# EAGLE design diode2 (EAGLE 9.6.2)
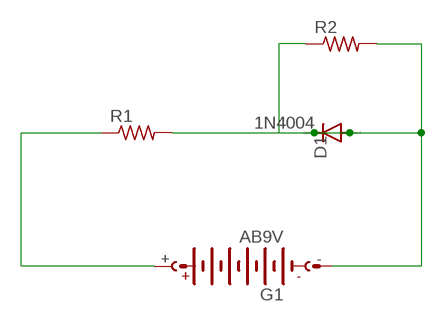
[diagram p0: schematic, sheet 1]

## Parts
D1  1N4004  [DO41-10]
G1  AB9V  [AB9V]
R1  R-US_R0805  [R0805]
R2  R-US_R0805  [R0805]

## Nets
N$1: G1.+ R1.1
N$2: D1.A D1.C G1.- R1.2 R2.1 R2.2

## Library data of the parts
D1 = diode:1N4004: DIODE general purpose rectifier, 1 A
G1 = battery:AB9V: 9-V BATTERY CLIP
R1 R2 = rcl:R-US_: RESISTOR, American symbol; SPICEPREFIX: R

## Board
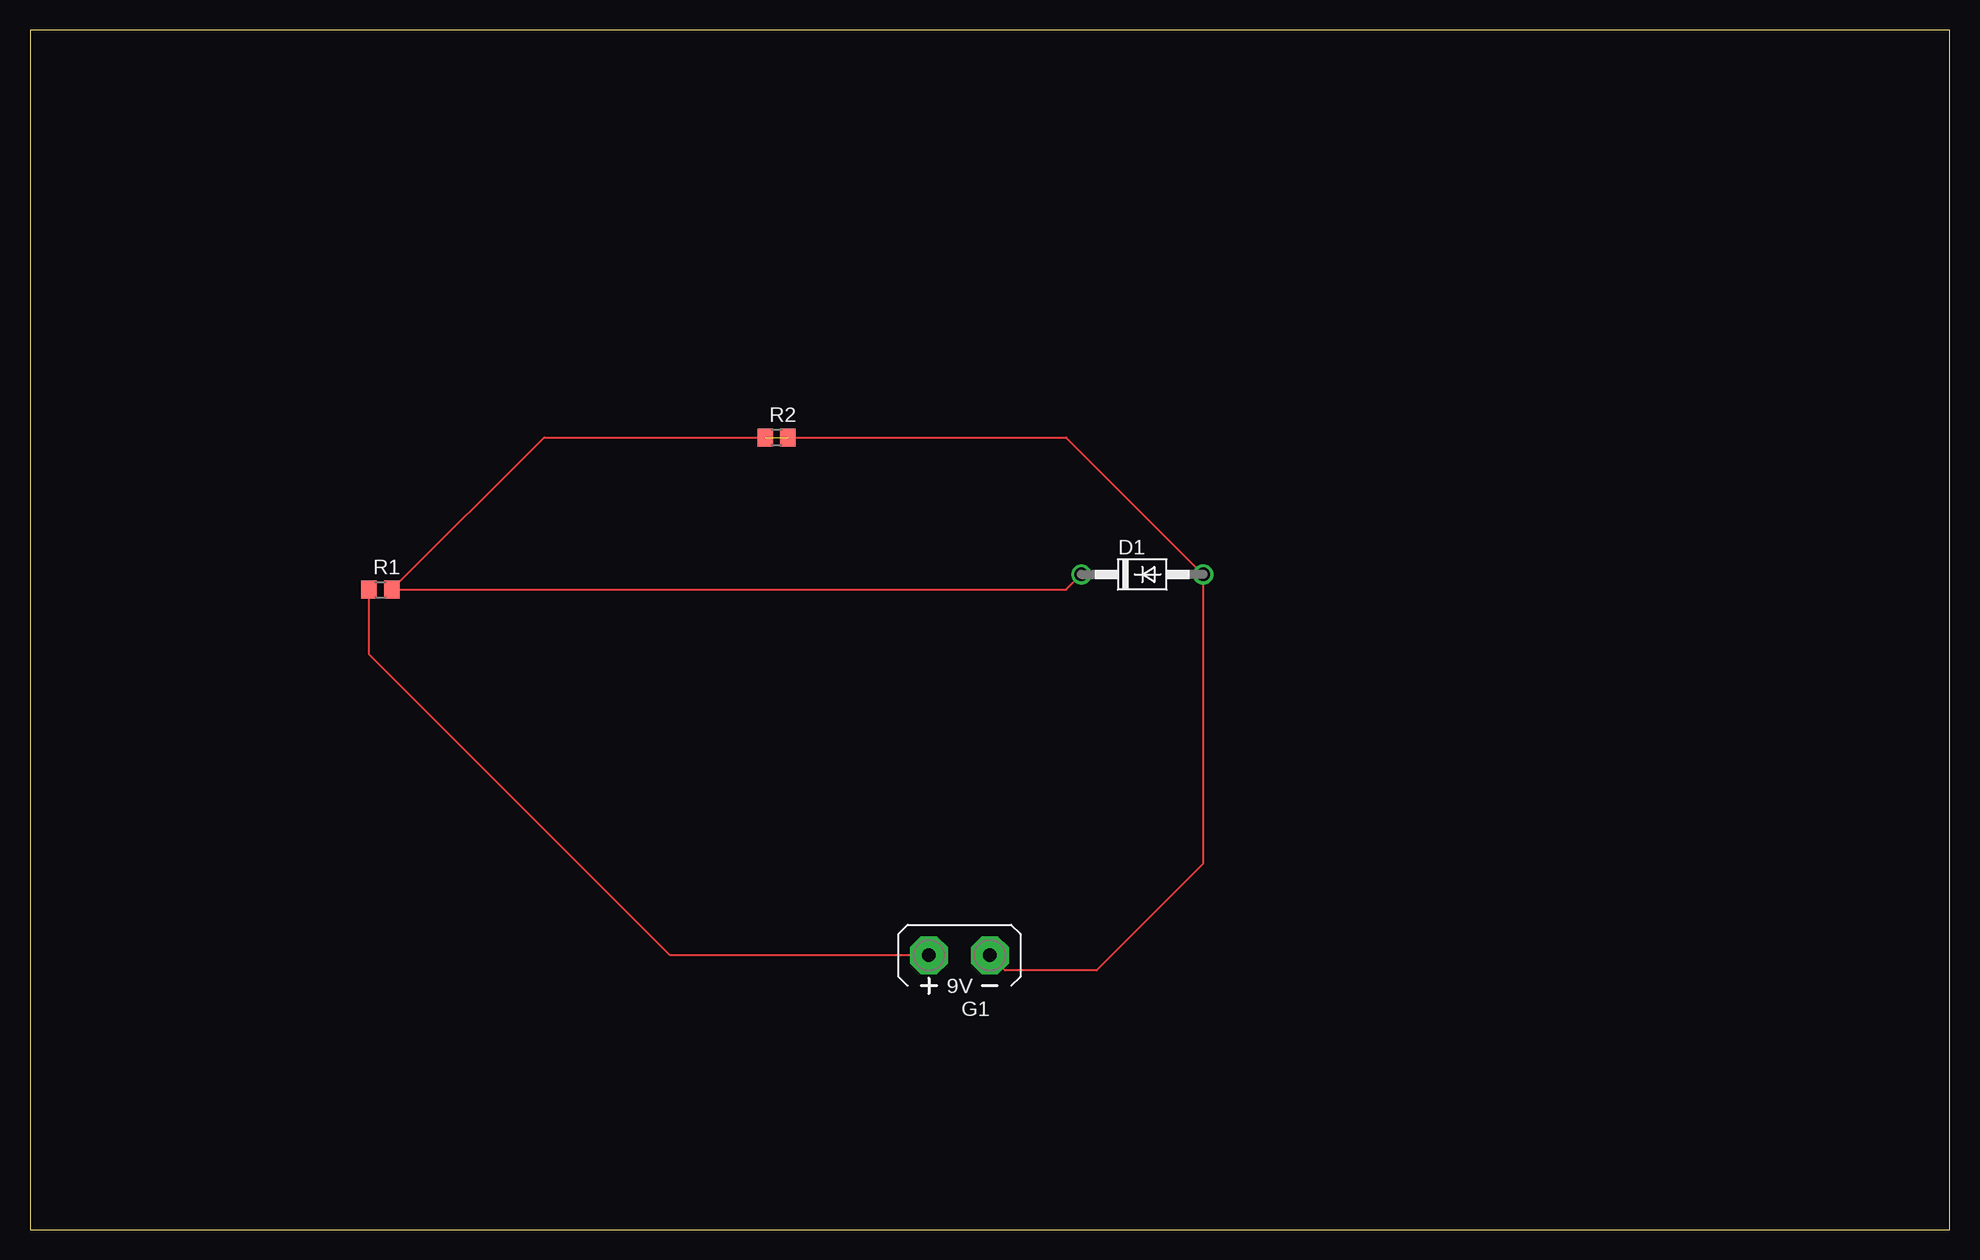
[diagram p1: board, top side]

Size 160 x 100 mm. Coordinates in mm from the lower left corner, seen from the top.
Outline: 0,0 160,0 160,100 0,100 0,0
Copper layers (1*16): Top 0.035mm / dielectric 1.5mm / Bottom 0.035mm
Design rules "default": minimum track width 6mil, minimum drill 0.35mm, track to track 6mil, track to pad 6mil, pad to pad 6mil, via to via 6mil, smd to smd 6mil, copper to edge 40mil, drill to drill 6mil, minimum pad ring 10mil, minimum via ring 8mil, stop-mask expansion 4mil, vias tented up to drill 0mil, thermal gap 10mil

### Footprints (pad centres in the part's own frame; a part is rotated, then mirrored left to right if it is on the bottom)
DO41-10 = drill 1.118: A 5.08,0; C -5.08,0
AB9V = drill 1.118 pad 3.15 octagon: + 0,2.54; - 0,-2.54
R0805 = smd 1.3 x 1.5: 1 -0.95,0; 2 0.95,0

### Placement (x,y rotation side)
D1  92.71,54.61 0 top
G1  77.47,22.86 90 top
R1  29.21,53.34 0 top
R2  62.23,66.04 0 top

### Tracks (layer width: path | path; a pad name or v marks a point on that pad's centre or on a via)
N$1
  Top 0.152: G1.+ 53.34,22.86 28.26,47.94 R1.1
N$2  (1 unrouted)
  Top 0.152: D1.C 86.36,53.34 R1.2 42.86,66.04 R2.1 | G1.- 81.28,21.59 88.9,21.59 97.79,30.48 D1.A 86.36,66.04 R2.2